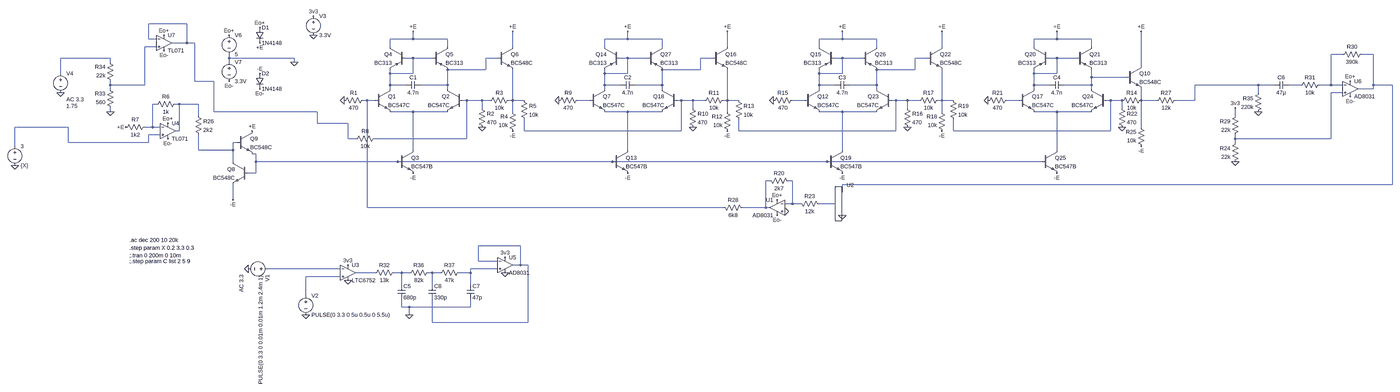
[diagram p0: schematic filtr v2.asc, whole sheet]
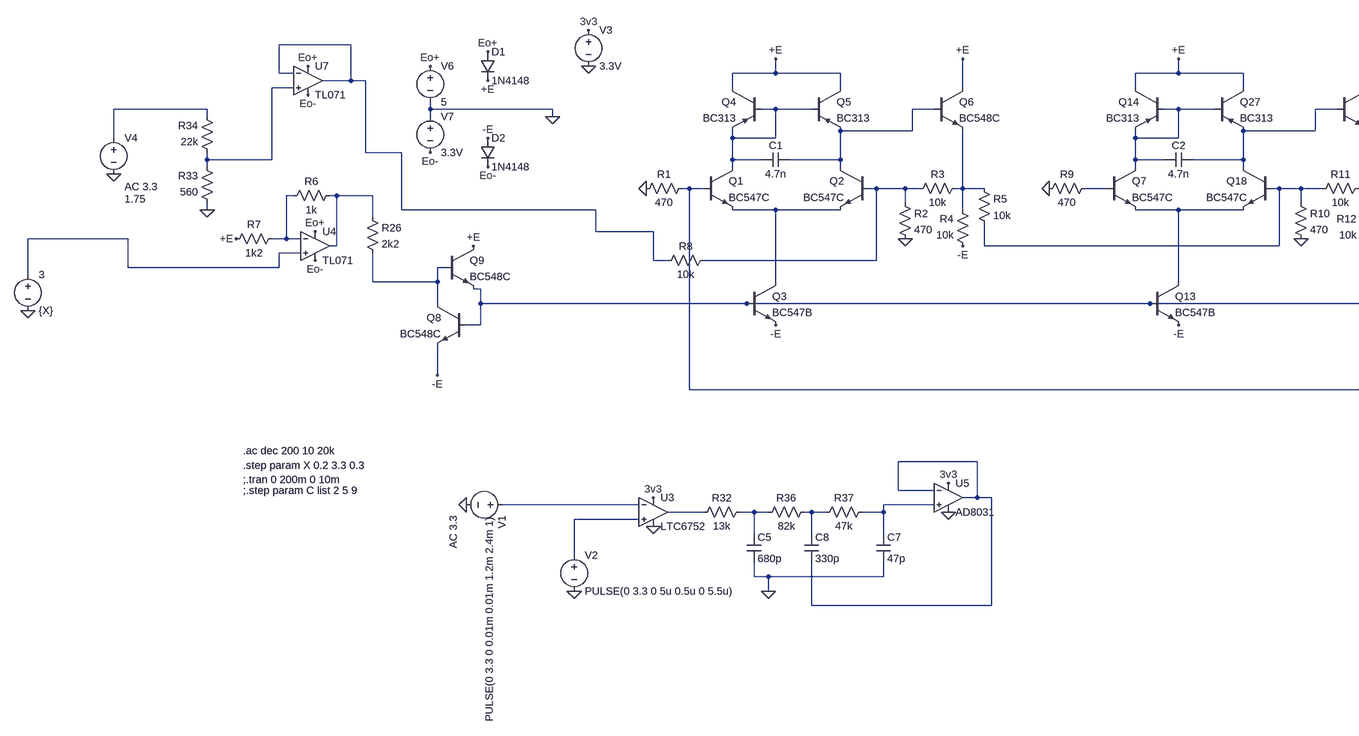
[diagram p1: schematic filtr v2.asc, part, row 1 of 1, column 1 of 2]
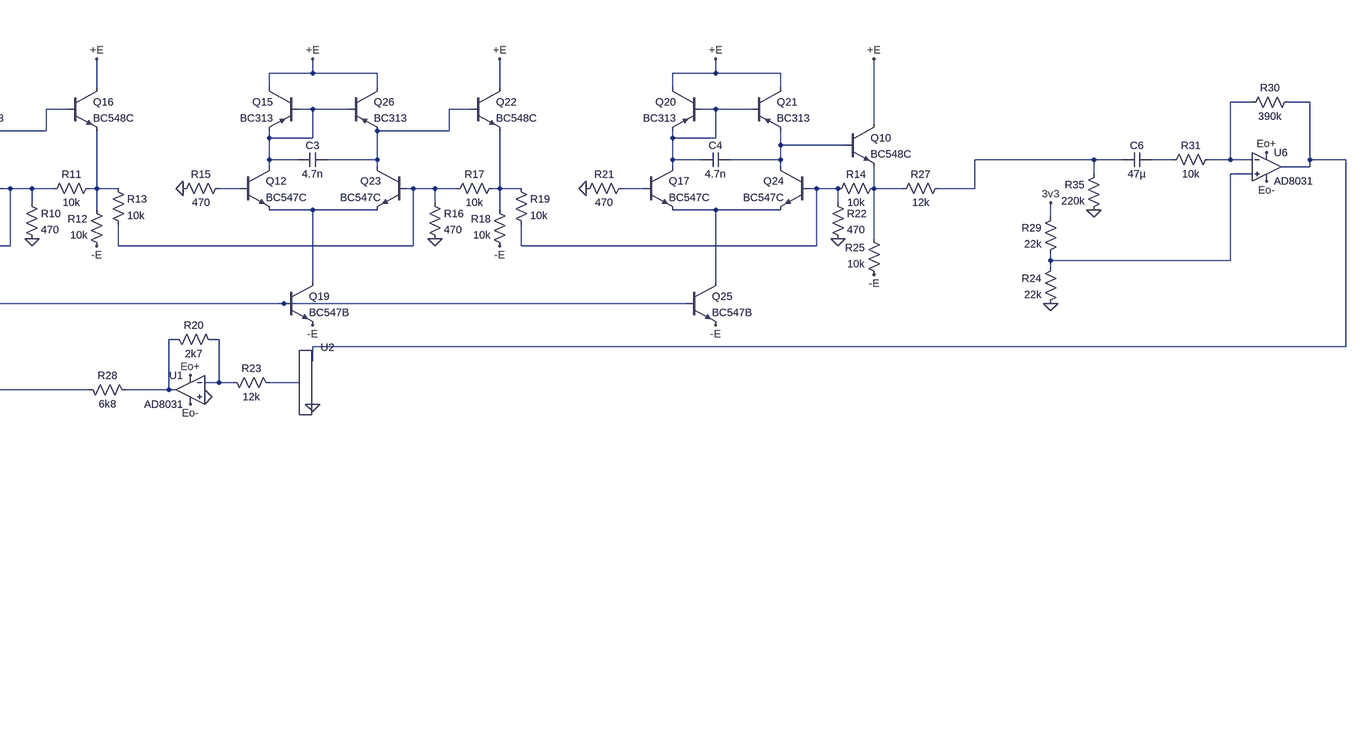
[diagram p2: schematic filtr v2.asc, part, row 1 of 1, column 2 of 2]
filtr v2.asc, the LTspice schematic file:
Version 4
SHEET 1 6064 1380
WIRE -800 -192 -960 -192
WIRE -960 -128 -960 -192
WIRE -928 -128 -960 -128
WIRE 144 -128 144 -160
WIRE 144 -128 48 -128
WIRE 288 -128 144 -128
WIRE 1040 -128 1040 -160
WIRE 1040 -128 944 -128
WIRE 1184 -128 1040 -128
WIRE 1936 -128 1936 -160
WIRE 1936 -128 1840 -128
WIRE 2080 -128 1936 -128
WIRE 2832 -128 2832 -160
WIRE 2832 -128 2736 -128
WIRE 2976 -128 2832 -128
WIRE -800 -112 -800 -192
WIRE -800 -112 -864 -112
WIRE -768 -112 -800 -112
WIRE -928 -96 -976 -96
WIRE 48 -96 48 -128
WIRE 288 -96 288 -128
WIRE 560 -96 560 -160
WIRE 944 -96 944 -128
WIRE 1184 -96 1184 -128
WIRE 1456 -96 1456 -160
WIRE 1840 -96 1840 -128
WIRE 2080 -96 2080 -128
WIRE 2352 -96 2352 -160
WIRE 2736 -96 2736 -128
WIRE 2976 -96 2976 -128
WIRE 4128 -64 4080 -64
WIRE 4256 -64 4208 -64
WIRE -1120 -48 -1328 -48
WIRE -624 -48 -624 -64
WIRE -352 -48 -624 -48
WIRE 144 -48 112 -48
WIRE 224 -48 144 -48
WIRE 496 -48 448 -48
WIRE 1040 -48 1008 -48
WIRE 1120 -48 1040 -48
WIRE 1392 -48 1344 -48
WIRE 1936 -48 1904 -48
WIRE 2016 -48 1936 -48
WIRE 2288 -48 2240 -48
WIRE 2832 -48 2800 -48
WIRE 2912 -48 2832 -48
WIRE -1120 -32 -1120 -48
WIRE -624 -32 -624 -48
WIRE -352 -32 -352 -48
WIRE 3184 -16 3184 -160
WIRE 448 0 448 -48
WIRE 448 0 288 0
WIRE 1344 0 1344 -48
WIRE 1344 0 1184 0
WIRE 2240 0 2240 -48
WIRE 2240 0 2080 0
WIRE -1328 16 -1328 -48
WIRE 48 16 48 0
WIRE 144 16 144 -48
WIRE 144 16 48 16
WIRE 944 16 944 0
WIRE 1040 16 1040 -48
WIRE 1040 16 944 16
WIRE 1840 16 1840 0
WIRE 1936 16 1936 -48
WIRE 1936 16 1840 16
WIRE 2736 16 2736 0
WIRE 2832 16 2832 -48
WIRE 2832 16 2736 16
WIRE 2976 32 2976 0
WIRE 3120 32 2976 32
WIRE -768 48 -768 -112
WIRE -688 48 -768 48
WIRE -1120 64 -1120 48
WIRE -976 64 -976 -96
WIRE -976 64 -1120 64
WIRE 48 64 48 16
WIRE 112 64 48 64
WIRE 288 64 288 0
WIRE 288 64 176 64
WIRE 944 64 944 16
WIRE 1008 64 944 64
WIRE 1184 64 1184 0
WIRE 1184 64 1072 64
WIRE 1840 64 1840 16
WIRE 1904 64 1840 64
WIRE 2080 64 2080 0
WIRE 2080 64 1968 64
WIRE 2736 64 2736 16
WIRE 2800 64 2736 64
WIRE 2976 64 2976 32
WIRE 2976 64 2864 64
WIRE 3776 64 3408 64
WIRE 3840 64 3776 64
WIRE 3952 64 3904 64
WIRE 4080 64 4080 -64
WIRE 4080 64 4032 64
WIRE 4128 64 4080 64
WIRE 4256 64 4256 -64
WIRE 4336 64 4256 64
WIRE -1120 80 -1120 64
WIRE 48 80 48 64
WIRE 288 80 288 64
WIRE 944 80 944 64
WIRE 1184 80 1184 64
WIRE 1840 80 1840 64
WIRE 2080 80 2080 64
WIRE 2736 80 2736 64
WIRE 2976 80 2976 64
WIRE 4256 80 4256 64
WIRE 4256 80 4192 80
WIRE 3776 96 3776 64
WIRE 4128 96 4080 96
WIRE -48 128 -64 128
WIRE -16 128 -48 128
WIRE 368 128 352 128
WIRE 432 128 368 128
WIRE 464 128 432 128
WIRE 560 128 560 0
WIRE 560 128 544 128
WIRE 608 128 560 128
WIRE 880 128 832 128
WIRE 1264 128 1248 128
WIRE 1312 128 1264 128
WIRE 1360 128 1312 128
WIRE 1456 128 1456 0
WIRE 1456 128 1440 128
WIRE 1504 128 1456 128
WIRE 1776 128 1728 128
WIRE 2160 128 2144 128
WIRE 2208 128 2160 128
WIRE 2256 128 2208 128
WIRE 2352 128 2352 0
WIRE 2352 128 2336 128
WIRE 2400 128 2352 128
WIRE 2672 128 2624 128
WIRE 3056 128 3040 128
WIRE 3104 128 3056 128
WIRE 3184 128 3184 80
WIRE 3248 128 3184 128
WIRE 3408 128 3408 64
WIRE 3408 128 3328 128
WIRE -928 144 -944 144
WIRE -832 144 -848 144
WIRE -752 144 -832 144
WIRE 432 160 432 128
WIRE 1312 160 1312 128
WIRE 2208 160 2208 128
WIRE 3104 160 3104 128
WIRE -1120 176 -1120 160
WIRE -688 176 -688 48
WIRE -256 176 -688 176
WIRE 144 176 48 176
WIRE 288 176 144 176
WIRE 560 176 560 128
WIRE 1040 176 944 176
WIRE 1184 176 1040 176
WIRE 1456 176 1456 128
WIRE 1936 176 1840 176
WIRE 2080 176 1936 176
WIRE 2352 176 2352 128
WIRE 2832 176 2736 176
WIRE 2976 176 2832 176
WIRE -752 192 -752 144
WIRE 3680 192 3680 160
WIRE -256 224 -256 176
WIRE -128 224 -256 224
WIRE -1296 240 -1552 240
WIRE -944 240 -944 144
WIRE -944 240 -976 240
WIRE -912 240 -944 240
WIRE 3184 240 3184 128
WIRE -832 256 -832 144
WIRE -832 256 -848 256
WIRE 608 256 608 208
WIRE 1264 256 1264 128
WIRE 1264 256 608 256
WIRE 1504 256 1504 208
WIRE 2160 256 2160 128
WIRE 2160 256 1504 256
WIRE 2400 256 2400 208
WIRE 3056 256 3056 128
WIRE 3056 256 2400 256
WIRE -912 272 -960 272
WIRE -128 288 -128 224
WIRE -96 288 -128 288
WIRE 368 288 368 128
WIRE 368 288 -16 288
WIRE 3680 288 3680 272
WIRE 4080 288 4080 96
WIRE 4080 288 3680 288
WIRE -1296 304 -1296 240
WIRE -960 304 -960 272
WIRE -960 304 -1296 304
WIRE -592 304 -608 304
WIRE 3680 304 3680 288
WIRE -1552 320 -1552 240
WIRE -752 336 -752 272
WIRE -608 336 -608 304
WIRE -608 336 -752 336
WIRE 144 336 144 176
WIRE 1040 336 1040 176
WIRE 1936 336 1936 176
WIRE 2832 336 2832 176
WIRE -512 352 -528 352
WIRE -608 384 -608 336
WIRE -512 384 -512 352
WIRE 80 384 -512 384
WIRE 976 384 80 384
WIRE 1872 384 976 384
WIRE 2768 384 1872 384
WIRE -512 432 -512 384
WIRE -512 432 -544 432
WIRE 1632 464 1616 464
WIRE 1728 464 1712 464
WIRE 4336 480 4336 64
WIRE 4336 480 1936 480
WIRE 1936 512 1936 480
WIRE -608 544 -608 480
WIRE 1728 560 1728 464
WIRE 1728 560 1696 560
WIRE 1760 560 1728 560
WIRE 1904 560 1840 560
WIRE -48 576 -48 128
WIRE 1440 576 -48 576
WIRE 1616 576 1616 464
WIRE 1616 576 1520 576
WIRE 1632 576 1616 576
WIRE 592 736 416 736
WIRE 416 800 416 736
WIRE 496 800 416 800
WIRE 592 816 592 736
WIRE 592 816 560 816
WIRE 624 816 592 816
WIRE -160 832 -464 832
WIRE 496 832 384 832
WIRE -16 848 -96 848
WIRE 96 848 64 848
WIRE 128 848 96 848
WIRE 224 848 208 848
WIRE 256 848 224 848
WIRE 384 848 384 832
WIRE 384 848 336 848
WIRE -160 864 -304 864
WIRE 96 896 96 848
WIRE 224 896 224 848
WIRE 384 896 384 848
WIRE -304 944 -304 864
WIRE 96 992 96 960
WIRE 128 992 96 992
WIRE 384 992 384 960
WIRE 384 992 128 992
WIRE 128 1024 128 992
WIRE 224 1056 224 960
WIRE 624 1056 624 816
WIRE 624 1056 224 1056
FLAG 144 432 -E
FLAG 144 -160 +E
FLAG -144 128 0
FLAG 432 240 0
FLAG 560 256 -E
FLAG 560 -160 +E
FLAG -608 544 -E
FLAG 1040 432 -E
FLAG 1040 -160 +E
FLAG 752 128 0
FLAG 1312 240 0
FLAG 1456 256 -E
FLAG 1456 -160 +E
FLAG 1936 432 -E
FLAG 1936 -160 +E
FLAG 1648 128 0
FLAG 2208 240 0
FLAG 2352 256 -E
FLAG 2352 -160 +E
FLAG 2832 432 -E
FLAG 2832 -160 +E
FLAG 2544 128 0
FLAG 3104 240 0
FLAG -352 -32 0
FLAG -496 16 -E
FLAG -496 -112 +E
FLAG -528 256 +E
FLAG 1936 608 0
FLAG 1696 592 0
FLAG -1552 400 0
FLAG -624 -144 Eo+
FLAG -624 48 Eo-
FLAG -880 224 Eo+
FLAG -880 288 Eo-
FLAG -496 -176 Eo+
FLAG -496 80 Eo-
FLAG -896 -144 Eo+
FLAG -896 -80 Eo-
FLAG -1120 176 0
FLAG 3776 176 0
FLAG 3184 -160 +E
FLAG 3184 320 -E
FLAG 3680 384 0
FLAG -272 -144 0
FLAG -272 -224 3v3
FLAG 3680 160 3v3
FLAG 1664 608 Eo-
FLAG 4160 112 Eo-
FLAG 1664 544 Eo+
FLAG 4160 48 Eo+
FLAG -304 1024 0
FLAG 128 1024 0
FLAG -128 816 3v3
FLAG 528 784 3v3
FLAG -128 880 0
FLAG 528 848 0
FLAG -544 832 0
FLAG -1056 240 +E
FLAG -1328 96 0
SYMBOL npn -16 80 R0
SYMATTR InstName Q1
SYMATTR Value BC547C
SYMBOL pnp 112 -96 M0
SYMATTR InstName Q4
SYMATTR Value BC313
SYMBOL res -160 144 R270
WINDOW 0 32 56 VTop 2
WINDOW 3 0 56 VBottom 2
SYMATTR InstName R1
SYMATTR Value 470
SYMBOL res 416 144 R0
SYMATTR InstName R2
SYMATTR Value 470
SYMBOL npn 496 -96 R0
SYMATTR InstName Q6
SYMATTR Value BC548C
SYMBOL res 560 112 R90
WINDOW 0 0 56 VBottom 2
WINDOW 3 32 56 VTop 2
SYMATTR InstName R3
SYMATTR Value 10k
SYMBOL res 576 272 R180
WINDOW 0 36 76 Left 2
WINDOW 3 36 40 Left 2
SYMATTR InstName R4
SYMATTR Value 10k
SYMBOL res 592 112 R0
SYMATTR InstName R5
SYMATTR Value 10k
SYMBOL cap 176 48 R90
WINDOW 0 0 32 VBottom 2
WINDOW 3 32 32 VTop 2
SYMATTR InstName C1
SYMATTR Value 4.7n
SYMBOL voltage -448 832 R90
WINDOW 3 24 44 Left 2
WINDOW 123 24 124 Left 2
WINDOW 39 0 0 Left 2
SYMATTR Value PULSE(0 3.3 0 0.01m 0.01m 1.2m 2.4m 1)
SYMATTR Value2 AC 3.3
SYMATTR InstName V1
SYMBOL npn -544 384 M0
SYMATTR InstName Q8
SYMATTR Value BC548C
SYMBOL npn -592 256 R0
SYMATTR InstName Q9
SYMATTR Value BC548C
SYMBOL res -112 304 R270
WINDOW 0 32 56 VTop 2
WINDOW 3 0 56 VBottom 2
SYMATTR InstName R8
SYMATTR Value 10k
SYMBOL res 736 144 R270
WINDOW 0 32 56 VTop 2
WINDOW 3 0 56 VBottom 2
SYMATTR InstName R9
SYMATTR Value 470
SYMBOL res 1296 144 R0
SYMATTR InstName R10
SYMATTR Value 470
SYMBOL npn 1392 -96 R0
SYMATTR InstName Q16
SYMATTR Value BC548C
SYMBOL res 1456 112 R90
WINDOW 0 0 56 VBottom 2
WINDOW 3 32 56 VTop 2
SYMATTR InstName R11
SYMATTR Value 10k
SYMBOL res 1472 272 R180
WINDOW 0 36 76 Left 2
WINDOW 3 36 40 Left 2
SYMATTR InstName R12
SYMATTR Value 10k
SYMBOL res 1488 112 R0
SYMATTR InstName R13
SYMATTR Value 10k
SYMBOL res 1632 144 R270
WINDOW 0 32 56 VTop 2
WINDOW 3 0 56 VBottom 2
SYMATTR InstName R15
SYMATTR Value 470
SYMBOL res 2192 144 R0
SYMATTR InstName R16
SYMATTR Value 470
SYMBOL npn 2288 -96 R0
SYMATTR InstName Q22
SYMATTR Value BC548C
SYMBOL res 2352 112 R90
WINDOW 0 0 56 VBottom 2
WINDOW 3 32 56 VTop 2
SYMATTR InstName R17
SYMATTR Value 10k
SYMBOL res 2368 272 R180
WINDOW 0 36 76 Left 2
WINDOW 3 36 40 Left 2
SYMATTR InstName R18
SYMATTR Value 10k
SYMBOL res 2384 112 R0
SYMATTR InstName R19
SYMATTR Value 10k
SYMBOL res 2528 144 R270
WINDOW 0 32 56 VTop 2
WINDOW 3 0 56 VBottom 2
SYMATTR InstName R21
SYMATTR Value 470
SYMBOL res 3088 144 R0
SYMATTR InstName R22
SYMATTR Value 470
SYMBOL res 1616 448 M90
WINDOW 0 0 56 VBottom 2
WINDOW 3 32 56 VTop 2
SYMATTR InstName R20
SYMATTR Value 2k7
SYMBOL res 1744 544 M90
WINDOW 0 0 56 VBottom 2
WINDOW 3 32 56 VTop 2
SYMATTR InstName R23
SYMATTR Value 12k
SYMBOL npn 80 336 R0
SYMATTR InstName Q3
SYMATTR Value BC547B
SYMBOL npn 976 336 R0
SYMATTR InstName Q13
SYMATTR Value BC547B
SYMBOL npn 1872 336 R0
SYMATTR InstName Q19
SYMATTR Value BC547B
SYMBOL npn 2768 336 R0
SYMATTR InstName Q25
SYMATTR Value BC547B
SYMBOL pnp 224 -96 R0
SYMATTR InstName Q5
SYMATTR Value BC313
SYMBOL pnp 1008 -96 M0
SYMATTR InstName Q14
SYMATTR Value BC313
SYMBOL pnp 1904 -96 M0
SYMATTR InstName Q15
SYMATTR Value BC313
SYMBOL pnp 2800 -96 M0
SYMATTR InstName Q20
SYMATTR Value BC313
SYMBOL pnp 2912 -96 R0
SYMATTR InstName Q21
SYMATTR Value BC313
SYMBOL pnp 2016 -96 R0
SYMATTR InstName Q26
SYMATTR Value BC313
SYMBOL pnp 1120 -96 R0
SYMATTR InstName Q27
SYMATTR Value BC313
SYMBOL EXTRA\\Misc\\pot 1936 560 R0
SYMATTR InstName U2
SYMATTR Value2 T=150/256
SYMBOL res 1536 592 M270
WINDOW 0 32 56 VTop 2
WINDOW 3 0 56 VBottom 2
SYMATTR InstName R28
SYMATTR Value 6k8
SYMBOL npn 352 80 M0
SYMATTR InstName Q2
SYMATTR Value BC547C
SYMBOL npn 880 80 R0
SYMATTR InstName Q7
SYMATTR Value BC547C
SYMBOL npn 1776 80 R0
SYMATTR InstName Q12
SYMATTR Value BC547C
SYMBOL npn 2672 80 R0
SYMATTR InstName Q17
SYMATTR Value BC547C
SYMBOL npn 1248 80 M0
SYMATTR InstName Q18
SYMATTR Value BC547C
SYMBOL npn 2144 80 M0
SYMATTR InstName Q23
SYMATTR Value BC547C
SYMBOL npn 3040 80 M0
SYMATTR InstName Q24
SYMATTR Value BC547C
SYMBOL cap 1072 48 R90
WINDOW 0 0 32 VBottom 2
WINDOW 3 32 32 VTop 2
SYMATTR InstName C2
SYMATTR Value 4.7n
SYMBOL cap 1968 48 R90
WINDOW 0 0 32 VBottom 2
WINDOW 3 32 32 VTop 2
SYMATTR InstName C3
SYMATTR Value 4.7n
SYMBOL cap 2864 48 R90
WINDOW 0 0 32 VBottom 2
WINDOW 3 32 32 VTop 2
SYMATTR InstName C4
SYMATTR Value 4.7n
SYMBOL voltage -1552 304 R0
WINDOW 123 0 0 Left 2
WINDOW 39 0 0 Left 2
SYMATTR InstName 3
SYMATTR Value {X}
SYMBOL res -832 128 R90
WINDOW 0 0 56 VBottom 2
WINDOW 3 32 56 VTop 2
SYMATTR InstName R6
SYMATTR Value 1k
SYMBOL res -960 224 R90
WINDOW 0 0 56 VBottom 2
WINDOW 3 32 56 VTop 2
SYMATTR InstName R7
SYMATTR Value 1k2
SYMBOL res -768 176 R0
SYMATTR InstName R26
SYMATTR Value 2k2
SYMBOL voltage -624 -160 R0
WINDOW 123 0 0 Left 2
WINDOW 39 0 0 Left 2
SYMATTR InstName V6
SYMATTR Value 5
SYMBOL voltage -624 -48 R0
WINDOW 123 0 0 Left 2
WINDOW 39 0 0 Left 2
SYMATTR InstName V7
SYMATTR Value 3.3V
SYMBOL EXTRA\\AudioOpamp\\TI\\TL071 -880 256 R0
SYMATTR InstName U4
SYMBOL diode -512 -176 R0
SYMATTR InstName D1
SYMATTR Value 1N4148
SYMBOL diode -512 16 R0
SYMATTR InstName D2
SYMATTR Value 1N4148
SYMBOL EXTRA\\AudioOpamp\\TI\\TL071 -896 -112 R0
SYMATTR InstName U7
SYMBOL res -1104 176 R180
WINDOW 0 36 76 Left 2
WINDOW 3 36 40 Left 2
SYMATTR InstName R33
SYMATTR Value 560
SYMBOL res -1104 64 R180
WINDOW 0 36 76 Left 2
WINDOW 3 36 40 Left 2
SYMATTR InstName R34
SYMATTR Value 22k
SYMBOL res 4224 -80 R90
WINDOW 0 0 56 VBottom 2
WINDOW 3 32 56 VTop 2
SYMATTR InstName R30
SYMATTR Value 390k
SYMBOL res 4048 48 R90
WINDOW 0 0 56 VBottom 2
WINDOW 3 32 56 VTop 2
SYMATTR InstName R31
SYMATTR Value 10k
SYMBOL cap 3904 48 R90
WINDOW 0 0 32 VBottom 2
WINDOW 3 32 32 VTop 2
SYMATTR InstName C6
SYMATTR Value 47µ
SYMBOL Opamps\\AD8031 4160 16 R0
SYMATTR InstName U6
SYMBOL res 3792 80 M0
SYMATTR InstName R35
SYMATTR Value 220k
SYMBOL npn 3120 -16 R0
SYMATTR InstName Q10
SYMATTR Value BC548C
SYMBOL res 3200 112 R90
WINDOW 0 0 56 VBottom 2
WINDOW 3 32 56 VTop 2
SYMATTR InstName R14
SYMATTR Value 10k
SYMBOL res 3200 336 R180
WINDOW 0 36 76 Left 2
WINDOW 3 36 40 Left 2
SYMATTR InstName R25
SYMATTR Value 10k
SYMBOL res 3344 112 R90
WINDOW 0 0 56 VBottom 2
WINDOW 3 32 56 VTop 2
SYMATTR InstName R27
SYMATTR Value 12k
SYMBOL res 3696 288 M0
SYMATTR InstName R24
SYMATTR Value 22k
SYMBOL res 3696 176 M0
SYMATTR InstName R29
SYMATTR Value 22k
SYMBOL voltage -272 -240 R0
WINDOW 123 0 0 Left 2
WINDOW 39 0 0 Left 2
SYMATTR InstName V3
SYMATTR Value 3.3V
SYMBOL Opamps\\AD8031 1664 512 M0
SYMATTR InstName U1
SYMBOL voltage -304 928 R0
WINDOW 123 0 0 Left 2
WINDOW 39 0 0 Left 2
SYMATTR InstName V2
SYMATTR Value PULSE(0 3.3 0 5u 0.5u 0 5.5u)
SYMBOL res 80 832 R90
WINDOW 0 0 56 VBottom 2
WINDOW 3 32 56 VTop 2
SYMATTR InstName R32
SYMATTR Value 13k
SYMBOL res 224 832 R90
WINDOW 0 0 56 VBottom 2
WINDOW 3 32 56 VTop 2
SYMATTR InstName R36
SYMATTR Value 82k
SYMBOL res 352 832 R90
WINDOW 0 0 56 VBottom 2
WINDOW 3 32 56 VTop 2
SYMATTR InstName R37
SYMATTR Value 47k
SYMBOL Opamps\\AD8031 528 752 R0
SYMATTR InstName U5
SYMBOL cap 80 896 R0
SYMATTR InstName C5
SYMATTR Value 680p
SYMBOL cap 368 896 R0
SYMATTR InstName C7
SYMATTR Value 47p
SYMBOL cap 208 896 R0
SYMATTR InstName C8
SYMATTR Value 330p
SYMBOL Comparators\\LTC6752 -128 784 R0
SYMATTR InstName U3
SYMBOL voltage -1328 0 R0
WINDOW 123 24 124 Left 2
WINDOW 39 0 0 Left 2
WINDOW 3 24 152 Left 2
SYMATTR Value2 AC 3.3
SYMATTR Value 1.75
SYMATTR InstName V4
TEXT -1040 712 Left 2 !.ac dec 200 10 20k
TEXT -1040 744 Left 2 !.step param X 0.2 3.3 0.3
TEXT -1040 776 Left 2 !;.tran 0 200m 0 10m
TEXT -1040 800 Left 2 !;.step param C list 2 5 9

The netlist it stands for:
* filtr v2.asc
Q1 N006 N017 N031 0 BC547C
Q4 +E N006 N006 0 BC313
R1 0 N017 470
R2 N018 0 470
Q6 +E N007 N019 0 BC548C
R3 N019 N018 10k
R4 -E N019 10k
R5 N019 N021 10k
C1 N007 N006 4.7n
V1 N042 0 PULSE(0 3.3 0 0.01m 0.01m 1.2m 2.4m 1) AC 3.3
Q8 N036 N037 -E 0 BC548C
Q9 +E N036 N037 0 BC548C
R8 N001 N018 10k
R9 0 N020 470
R10 N021 0 470
Q16 +E N009 N022 0 BC548C
R11 N022 N021 10k
R12 -E N022 10k
R13 N022 N024 10k
R15 0 N023 470
R16 N024 0 470
Q22 +E N011 N025 0 BC548C
R17 N025 N024 10k
R18 -E N025 10k
R19 N025 N027 10k
R21 0 N026 470
R22 N027 0 470
R20 N038 N039 2k7
R23 N039 N040 12k
Q3 N031 N037 -E 0 BC547B
Q13 N032 N037 -E 0 BC547B
Q19 N033 N037 -E 0 BC547B
Q25 N034 N037 -E 0 BC547B
Q5 +E N006 N007 0 BC313
Q14 +E N008 N008 0 BC313
Q15 +E N010 N010 0 BC313
Q20 +E N012 N012 0 BC313
Q21 +E N012 N013 0 BC313
Q26 +E N010 N011 0 BC313
Q27 +E N008 N009 0 BC313
XU2 N004 0 N040 T=150/256
R28 N038 N017 6k8
Q2 N007 N018 N031 0 BC547C
Q7 N008 N020 N032 0 BC547C
Q12 N010 N023 N033 0 BC547C
Q17 N012 N026 N034 0 BC547C
Q18 N009 N021 N032 0 BC547C
Q23 N011 N024 N033 0 BC547C
Q24 N013 N027 N034 0 BC547C
C2 N009 N008 4.7n
C3 N011 N010 4.7n
C4 N013 N012 4.7n
V§3 N035 0 {X}
R6 N030 N029 1k
R7 N029 +E 1k2
R26 N030 N036 2k2
V6 Eo+ 0 5
V7 0 Eo- 3.3V
* U4: TL071 (symbol EXTRA\AudioOpamp\TI\TL071 not available, pins judged from their places): In+=N035 In-=N029 V+=Eo+ V-=Eo- OUT=N030
D1 Eo+ +E 1N4148
D2 -E Eo- 1N4148
* U7: TL071 (symbol EXTRA\AudioOpamp\TI\TL071 not available, pins judged from their places): In+=N002 In-=N001 V+=Eo+ V-=Eo- OUT=N001
R33 0 N002 560
R34 N002 N005 22k
R30 N004 N003 390k
R31 N003 N015 10k
C6 N015 N014 47µ
XU6 N016 N003 Eo+ Eo- N004 AD8031  ; pins In+ In- V+ V- OUT
R35 N014 0 220k
Q10 +E N013 N028 0 BC548C
R14 N028 N027 10k
R25 -E N028 10k
R27 N014 N028 12k
R24 N016 0 22k
R29 3v3 N016 22k
V3 3v3 0 3.3V
XU1 0 N039 Eo+ Eo- N038 AD8031  ; pins In+ In- V+ V- OUT
V2 N047 0 PULSE(0 3.3 0 5u 0.5u 0 5.5u)
R32 N045 N044 13k
R36 N046 N045 82k
R37 N043 N046 47k
XU5 N043 N041 3v3 0 N041 AD8031  ; pins In+ In- V+ V- OUT
C5 N045 0 680p
C7 N043 0 47p
C8 N046 N041 330p
XU3 N047 N042 3v3 0 N044 LTC6752  ; pins In+ In- V+ V- OUT
V4 N005 0 1.75 AC 3.3
.model D D
.lib standard.dio
.model NPN NPN
.model PNP PNP
.lib standard.bjt
.ac dec 200 10 20k
.step param X 0.2 3.3 0.3
;.tran 0 200m 0 10m
;.step param C list 2 5 9
.lib POT.lib
.lib LTC7.lib
.backanno
.end